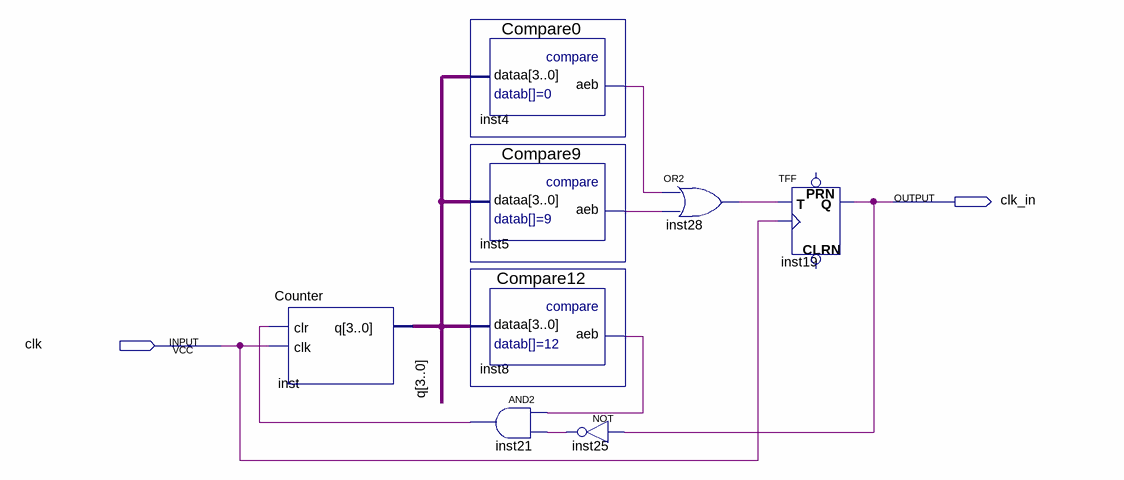
[diagram p0: schematic sheet]
// Quartus schematic Block1.bdf as structural Verilog: 8 symbols, 2 pins
module Block1 (
  input  clk,
  output clk_in
);

  wire inst4_aeb, inst5_aeb, inst8_aeb, inst21_out, inst25_out, inst28_out;
  wire [3:0] q;

  Counter inst (.clr(inst21_out), .clk(clk), .q(q));
  Compare0 inst4 (.dataa(q), .aeb(inst4_aeb));
  Compare9 inst5 (.dataa(q), .aeb(inst5_aeb));
  Compare12 inst8 (.dataa(q), .aeb(inst8_aeb));
  and inst21 (inst21_out, inst8_aeb, inst25_out);
  not inst25 (inst25_out, clk_in);
  or inst28 (inst28_out, inst4_aeb, inst5_aeb);
  TFF inst19 (.T(inst28_out), .CLK(clk), .Q(clk_in));  // open: PRN, CLRN
endmodule
